# Altium schematic sheet Module_CYW20737A1KML2G.SchDoc
size A3; SheetNumber: 1; SheetTotal: 1
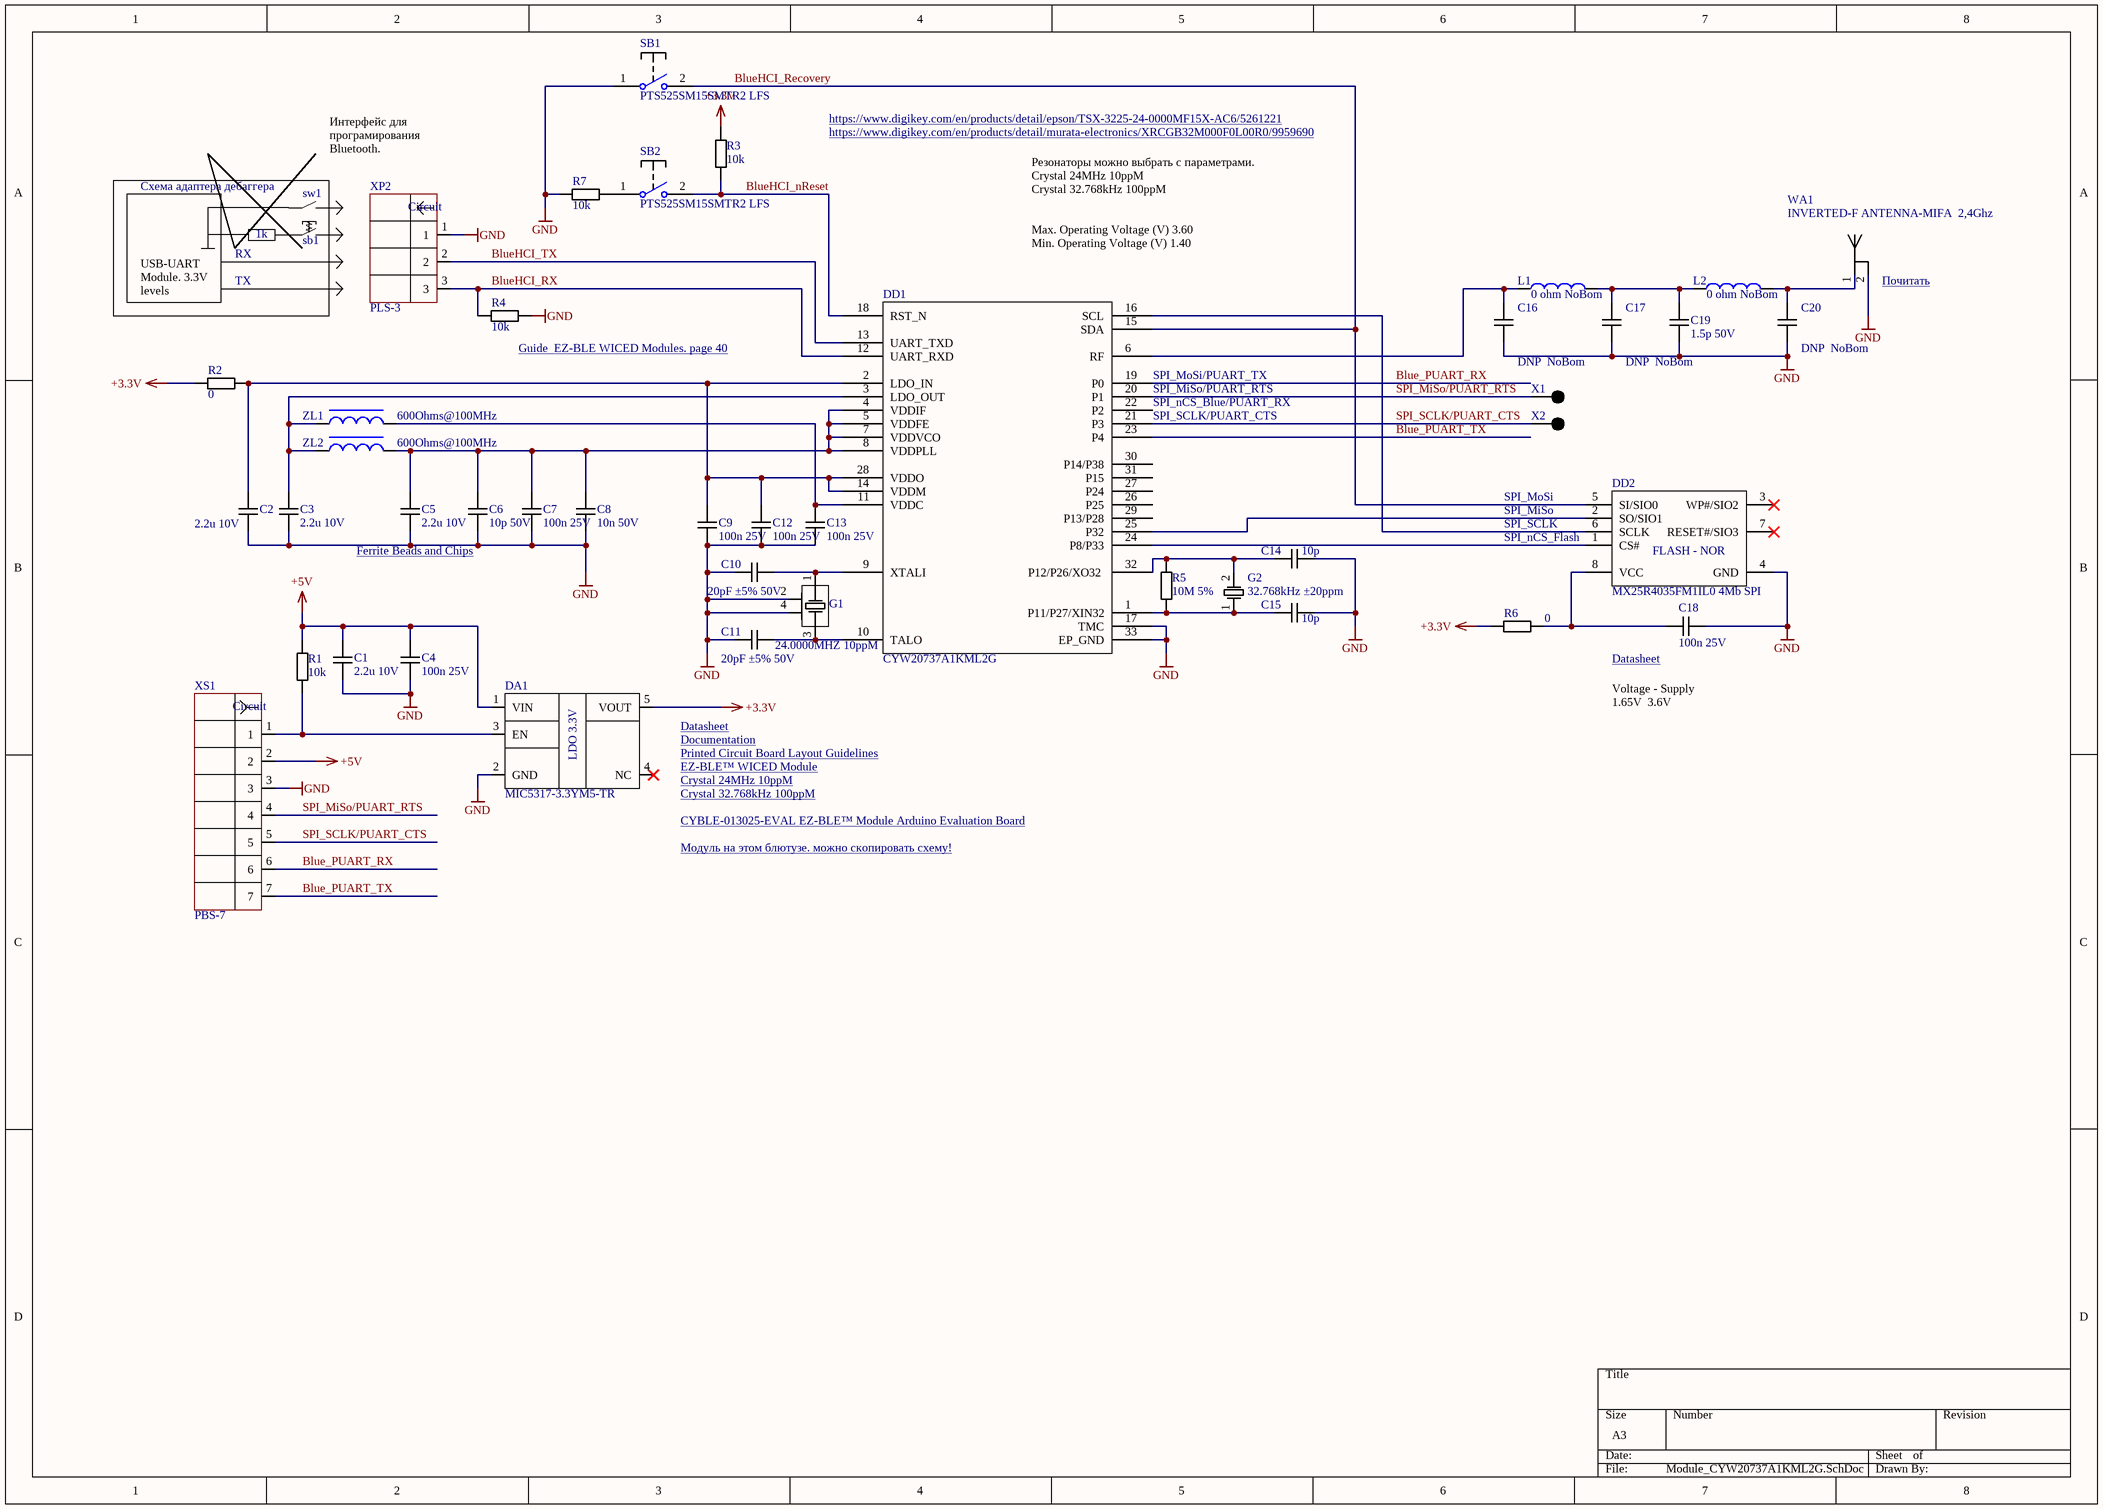
[diagram p0: Module_CYW20737A1KML2G.SchDoc]

## Parts
C1  2.2u 10V  [CapKemet1005(0402)]
C2  2.2u 10V  [CapKemet1005(0402)]
C3  2.2u 10V  [CapKemet1005(0402)]
C4  100n 25V  [CapKemet1005(0402)]
C5  2.2u 10V  [CapKemet1005(0402)]
C6  10p 50V  [CapKemet1005(0402)]
C7  100n 25V  [CapKemet1005(0402)]
C8  10n 50V  [CapKemet1005(0402)]
C9  100n 25V  [CapKemet1005(0402)]
C10  20pF ±5% 50V  [CapKemet1005(0402)]
C11  20pF ±5% 50V  [CapKemet1005(0402)]
C12  100n 25V  [CapKemet1005(0402)]
C13  100n 25V  [CapKemet1005(0402)]
C14  10p  [CapKemet1005(0402)]
C15  10p  [CapKemet1005(0402)]
C16  DNP  NoBom  [CapKemet1005(0402)]  (no BOM)
C17  DNP  NoBom  [CapKemet1005(0402)]  (no BOM)
C18  100n 25V  [CapKemet1005(0402)]
C19  1.5p 50V  [CapKemet1005(0402)]
C20  DNP  NoBom  [CapKemet1005(0402)]  (no BOM)
DA1  MIC5317-3.3YM5-TR  [SOT-23-OT5_N]
DD1  CYW20737A1KML2G  [QFN5X5-32_N]
DD2  MX25R4035FM1IL0 4Mb SPI  [MCHP-SOIC-SN8_M]
G1  24.0000MHZ 10ppM  [TSX-3225]
G2  32.768kHz ±20ppm  [VMK3-9005]
L1  0 ohm NoBom  [INDC1608(0603)N]  (no BOM)
L2  0 ohm NoBom  [INDC1608(0603)N]  (no BOM)
R1  10k  [REZKemet 0402]
R2  0  [REZKemet 0402]
R3  10k  [REZKemet 0402]
R4  10k  [REZKemet 0402]
R5  10M 5%  [REZKemet 0402]
R6  0  [REZKemet 0402]
R7  10k  [REZKemet 0402]
SB1  PTS525SM15SMTR2 LFS  [TACT_SWITCH KPT1187B]
SB2  PTS525SM15SMTR2 LFS  [TACT_SWITCH KPT1187B]
WA1  INVERTED-F ANTENNA-MIFA  2,4Ghz  [INVERTED-F ANTENNA-MIFA]  (net tie, no BOM)
X1  PLLS1.27-1-TOP-R  [PLLS1.27-1-TOP-R]  (value not drawn)
X2  PLLS1.27-1-TOP-R  [PLLS1.27-1-TOP-R]  (value not drawn)
XP2  PLS-3  [PLS-3-3D]
XS1  PBS-7  [PBS-7-3D]
ZL1  600Ohms@100MHz  [Ferrite1005(0402)]
ZL2  600Ohms@100MHz  [Ferrite1005(0402)]

## Nets
+3.3V: DA1.5(VOUT) R2.2 R3.2 R6.1
+5V: C1.2 C4.2 DA1.1(VIN) R1.2 XS1.2
GND: C1.1 C2.1 C3.1 C4.1 C5.1 C6.1 C7.1 C8.1 C9.1 C10.1 C11.1 C12.1 C13.1 C14.1 C15.1 C16.1 C17.1 C18.1 C19.1 C20.1 DA1.2(GND) DD1.17(TMC) DD1.33(EP_GND) DD2.4(GND) G1.2 G1.4 R4.1 R7.2 SB1.1(COMMON) WA1.2 XP2.1 XS1.3
Blue_PUART_RX: DD1.19(P0) XS1.6
Blue_PUART_TX: DD1.23(P4) XS1.7
BlueHCI_nReset: DD1.18(RST_N) R3.1 SB2.2(NO)
BlueHCI_Recovery: DD1.15(SDA) DD2.5(SI/SIO0) SB1.2(NO)
BlueHCI_RX: DD1.12(UART_RXD) R4.2 XP2.3
BlueHCI_TX: DD1.13(UART_TXD) XP2.2
SPI_MiSo/PUART_RTS: DD1.20(P1) X1.1 XS1.4
SPI_SCLK/PUART_CTS: DD1.21(P3) X2.1 XS1.5
NetC2_2: C2.2 C9.2 C12.2 DD1.2(LDO_IN) DD1.14(VDDM) DD1.28(VDDO) R2.1
NetC3_2: C3.2 DD1.3(LDO_OUT) ZL1.1 ZL2.1
NetC5_2: C5.2 C6.2 C7.2 C8.2 DD1.4(VDDIF) DD1.5(VDDFE) DD1.7(VDDVCO) DD1.8(VDDPLL) ZL2.2
NetC10_2: C10.2 DD1.9(XTALI) G1.1
NetC11_2: C11.2 DD1.10(TALO) G1.3
NetC13_2: C13.2 DD1.11(VDDC) ZL1.2
NetC14_2: C14.2 DD1.32(P12/P26/XO32) G2.2 R5.2
NetC15_2: C15.2 DD1.1(P11/P27/XIN32) G2.1 R5.1
NetC16_2: C16.2 DD1.6(RF) L1.1
NetC17_2: C17.2 C19.2 L1.2 L2.1
NetC18_2: C18.2 DD2.8(VCC) R6.2
NetC20_2: C20.2 L2.2 WA1.1
NetDA1_3: DA1.3(EN) R1.1 XS1.1
NetDD1_16: DD1.16(SCL) DD2.6(SCLK)
NetDD1_24: DD1.24(P8/P33) DD2.1(CS#)
NetDD1_25: DD1.25(P32) DD2.2(SO/SIO1)
NetR7_1: R7.1 SB2.1(COMMON)

Not connected (* = marked no-connect by the designer): DA1 4(NC)*; DD1 22(P2) 26(P25) 27(P24) 29(P13/P28) 30(P14/P38) 31(P15); DD2 3(WP#/SIO2)* 7(RESET#/SIO3)*

## Notes on the sheet
- Интерфейс для програмирования Bluetooth.
- https://www.digikey.com/en/products/detail/epson/TSX-3225-24-0000MF15X-AC6/5261221
- https://www.digikey.com/en/products/detail/murata-electronics/XRCGB32M000F0L00R0/9959690
- Схема адаптера дебаггера
- 1k
- sb1
- sw1
- Резонаторы можно выбрать с параметрами.
  Crystal 24MHz 10ppM
  Crystal 32.768kHz 100ppM
- USB-UART Module. 3.3V levels
- RX
- TX
- Max. Operating Voltage (V) 3.60
  Min. Operating Voltage (V) 1.40
- (near WA1) Почитать <https://devzone.nordicsemi.com/f/nordic-q-a/64229/ble-beacon-2-4ghz-pcb-antenna-layout-for-soc-nordic-nrf52832>
- (near R4) Guide  EZ-BLE WICED Modules. page 40 <https://www.cypress.com/file/396961/download>
- (near DD1) SPI_MoSi/PUART_TX
- (near DD1) SPI_MiSo/PUART_RTS
- (near DD1) SPI_nCS_Blue/PUART_RX
- (near DD1) SPI_SCLK/PUART_CTS
- SPI_MoSi
- SPI_MiSo
- Ferrite Beads and Chips <https://www.digikey.com/en/products/filter/ferrite-beads-and-chips/841?s=N4IgjCBcpgbFoDGUBmBDANgZwKYBoQB7KAbRAGYBOMAVgA4QBdAgBwBcoQBlNgJwEsAdgHMQAXwJhKdSghDJI6bPiKkQABiasOkbnyGiJIAEzG6m6PNSZcBYpDKx16gAQB5ABYBbLC4ACLmDOALIAEgBeWiDsnADChACuLBg4ACYAqoL8bG4owThoWAm8OOIEALTGcgp8CSr2ZDRRMbriRvCW-Kmc5UEQ2pwgBACObACenP0g4yyluoXIYmJAA>
- SPI_SCLK
- (near DD2) SPI_nCS_Flash
- (near C18) Datasheet <https://www.macronix.com/Lists/Datasheet/Attachments/7425/MX25R4035F,%20Wide%20Range,%204Mb,%20v1.4.pdf>
- Voltage - Supply
  1.65V  3.6V
- (near DA1) Crystal 24MHz 10ppM <https://www.digikey.com/en/products/filter/crystals/171?s=N4IgjCBcpgbFoDGUBmBDANgZwKYBoQB7KAbRACZyAOAZlgHYQC4rZYAWJ8WV2ATi4se5LuQAM5AKywIBSrTqjqNGoznKaA9bXYjtNaUtqStFZbDFG6es7Vg0rHR-AC6BAA4AXKCADKngCcASwA7AHMQAF8CfgQQZEh0bHwiUhB2MT5NBzcQLx9-YPCoggBaEWh4qECAVxTiSDJJEFz8yBAo6JBmyvcoMA8%2ByDAxMS74SqCAEx9Skdk873auAEdPAE8fBY33HB80LGRIyKA>
- (near DA1) Datasheet <https://www.cypress.com/file/333436/download>
- (near DA1) Documentation <https://www.cypress.com/part/cyw20737a1kml2g>
- (near DA1) Printed Circuit Board Layout Guidelines <https://www.cypress.com/file/298151/download>
- (near DA1) EZ-BLE™ WICED Module <https://www.digikey.com.au/htmldatasheets/production/2902866/0/0/1/CYBLE-013025-00-CYBLE-013030-00.pdf>
- (near DA1) Crystal 32.768kHz 100ppM <https://www.digikey.com/en/products/filter/crystals/171?s=N4IgjCBcpgbFoDGUBmBDANgZwKYBoQB7KAbRACZyAOAZlgHYQC4rZYAWJ8WV2ATi4se5LuQAM5AKywIBSrTqjqNGoznKaA9bXYjtNaUtqStFZbDFG6es7Vg0rHR-AC6BAA4AXKCADKngCcASwA7AHMQAF8CfgQQZEh0bHwiUhB2MT5NBzcQLx9-YPCoggBaEWh4qECAVxTiSDJJEFz8yBAo6JBmyvcoMA8%2ByDAxMS74SqCAEx9Skdk873auAEdPAE8fBY33HB80LGRIyKA>
- CYBLE-013025-EVAL EZ-BLE™ Module Arduino Evaluation Board <https://www.cypress.com/documentation/development-kitsboards/cyble-013025-eval-ez-ble-module-arduino-evaluation-board>
- Модуль на этом блютузе. можно скопировать схему! <https://www.cypress.com/part/cyble-013025-00>
- (in symbol MIC5317-3.3YM5-TR) LDO 3.3V
- (in symbol MX25R4035FM1IL0) FLASH - NOR
- (in symbol PBS-7) Circuit
- (in symbol PLS-3) Circuit

## Library data of the parts
C1-C3 C5 = LMK105BJ225MV-F: CAP CER 2.2uF 10V X5R 0402; Part Number: LMK105BJ225MV-F; Digi-Key Part Number: 587-3153-1-ND; HelpURL: https://www.digikey.com/en/products/detail/taiyo-yuden/LMK105BJ225MV-F/2774764; Manufacturer Part Number: LMK105BJ225MV-F; Price$: 0.01452; Package: 0402
C4 C7 C9 C12 C13 C18 = CL05B104KA5NNNC: CAP CER 0.1UF 25V X7R 0402; Part Number: CL05B104KA5NNNC; Digi-Key Part Number: 1276-6720-1-ND; HelpURL: https://www.digikey.com/en/products/detail/samsung-electro-mechanics/CL05B104KA5NNNC/5961204; Manufacturer Part Number: CL05B104KA5NNNC; Price$: 0.00487; Package: 0402
C6 = CL05C100DB5NNNC: CAP CER 10PF 50V C0G/NP0 0402; Part Number: CL05C100DB5NNNC; HelpURL: https://www.digikey.com/en/products/detail/samsung-electro-mechanics/CL05C100DB5NNNC/3887283; Digi-Key Part Number: 1276-1625-1-ND; Price$: 0.00647; Manufacturer Part Number: CL05C100DB5NNNC; Package: 0402
C8 = CL05B103KB5NNNC: CAP CER 10000PF 50V X7R 0402; Part Number: CL05B103KB5NNNC; HelpURL: https://www.digikey.com/en/products/detail/samsung-electro-mechanics/CL05B103KB5NNNC/3886686; Digi-Key Part Number: 1276-1028-1-ND; Price$: 0.00399; Manufacturer Part Number: CL05B103KB5NNNC; Package: 0402
C10 C11 = CC0402JRNPO9BN200: 20pF ±5% 50V Ceramic Capacitor C0G, NP0 0402 (1005 Metric); Part Number: CC0402JRNPO9BN200; HelpURL: https://www.digikey.com/en/products/detail/yageo/CC0402JRNPO9BN200/2833582; Digi-Key Part Number: 311-1417-1-ND; Price$: 0,1; Manufacturer Part Number: CC0402JRNPO9BN200
C14 C15 = CC0402DRNPO9BN100: 10pF 0402 50V C0G  +/-0.5pF; Part Number: CC0402DRNPO9BN100; HelpURL: https://www.digikey.com/en/products/detail/yageo/CC0402DRNPO9BN100/2297890?s=N4IgTCBcDaIMJwAwBZFgCICUByAFA8gJwBC2AjIoiALoC%2BQA; Price$: 0.1; Manufacturer Part Number: CC0402DRNPO9BN100; Package: 0402; Mouser Part Number: 603-CC402DRNPO9BN100
C16 C17 C20 = GCM1555C1H151JA16D: 150pF 0402 50V NP0  +/-5%; Part Number: GCM1555C1H151JA16D; HelpURL: https://eu.mouser.com/ProductDetail/Murata-Electronics/GCM1555C1H151JA16D?qs=%2Fha2pyFadugcbh64YeyVIuIl%252BPkOajCwN%252Ba25dmljYEPyTqNgKhHVA%3D%3D; Price$: 0.1; Manufacturer Part Number: GCM1555C1H151JA16D; Package: 0402; Mouser Part Number: 81-GCM1555C1H151J16D
C19 = CL05C1R5BB5NNNC: CAP CER 1.5pF 50V COG 0402 ±0.1pF; Part Number: CL05C1R5BB5NNNC; HelpURL: https://www.digikey.com/en/products/detail/samsung-electro-mechanics/CL05C1R5BB5NNNC/3887314; Digi-Key Part Number: 1276-1656-1-ND; Price$: 0.00874; Manufacturer Part Number: CL05C1R5BB5NNNC; Package: 0402
DA1 = MIC5317-3.3YM5-TR: Linear Voltage Regulator IC 1 Output 150mA SOT-23-5; Part Number: MIC5317-3.3YM5-TR; HelpURL: https://www.digikey.com/product-detail/en/microchip-technology/MIC5317-3.3YM5-TR/MIC5317-3.3YM5-CT-ND/7671939; Price$: 0,16; Digi-Key Part Number: MIC5317-3.3YM5-CT-ND; Manufacturer Part Number: MIC5317-3.3YM5-TR
DD1 = CYW20737A1KML2G: IC RF TXRX+MCU BLUETOOTH 32VFQFN; Part Number: CYW20737A1KML2G; HelpURL: https://www.digikey.com/en/products/detail/cypress-semiconductor-corp/CYW20737A1KML2G/6592884; Price$: 0,86; Digi-Key Part Number: 2015-CYW20737A1KML2G-ND; Manufacturer Part Number: CYW20737A1KML2G
DD2 = MX25R4035FM1IL0: IC FLASH 4M SPI 33MHZ 8SOP; Note: SOP 8L(150mil); Part Number: MX25R4035FM1IL0; HelpURL: https://www.digikey.com/en/products/detail/macronix/MX25R4035FM1IL0/6558612; Digi-Key Part Number: MX25R4035FM1IL0; Manufacturer Part Number: MX25R4035FM1IL0; Package: 8-SOP
G1 = TSX-3225 24.0000MF15X-AC6: 24MHz ±10ppm Crystal 9pF 40 Ohms 4-SMD, No Lead; Part Number: TSX-3225 24.0000MF15X-AC6; HelpURL: https://www.digikey.com/en/products/detail/epson/TSX-3225-24-0000MF15X-AC6/5261221; Price$: 0.33; Digi-Key Part Number: SER4180CT-ND; Manufacturer Part Number: TSX-3225 24.0000MF15X-AC6
G2 = VMK3-9005-32K7680000: 32.768kHz ±20ppm Crystal   2-SMD, No Lead; Part Number: VMK3-9005-32K7680000; HelpURL: https://www.digikey.com/en/products/detail/microchip-technology/VMK3-9005-32K7680000/13175117; Price$: 0.34; Digi-Key Part Number: 150-VMK3-9005-32K7680000CT-ND; Manufacturer Part Number: VMK3-9005-32K7680000
L1 L2 = AISC-0603-R27G-T: Fixed Inductors 270nH 2% -40C +125C; Part Number: AISC-0603-R27G-T; HelpURL: https://eu.mouser.com/ProductDetail/ABRACON/AISC-0603-R27G-T?qs=%2Fha2pyFaduhMG%2FX31G0KOK4wVUuURxruJbjcpPhZfbyFA8e1ZTy%2F3Q%3D%3D; Manufacturer Part Number: AISC-0603-R27G-T; Mouser Part Number: 815-AISC0603R27GT
R1 R3 R4 R7 = RESC1005(0402): RES SMD 5.1K OHM 1% 1/10W 0402; Manufacturer Part Number: ERJ-2RKF5101X; Part Number: RESC1005(0402); HelpURL: https://eu.mouser.com/ProductDetail/ROHM-Semiconductor/SFR01MZPF5101?qs=sGAEpiMZZMvdGkrng054t7z4BkURc4Lz8VVRSaz2ejIiXEQeYNXBXw%3D%3D; Price$: 0.1; Package: 0402; Mouser Part Number: 755-SFR01MZPF5101
R2 R6 = RMCF0402ZT0R00: RES SMD 0402 0 Ohm; Part Number: RMCF0402ZT0R00; HelpURL: https://www.digikey.com/en/products/detail/stackpole-electronics-inc/RMCF0402ZT0R00/1756905; Manufacturer Part Number: RMCF0402ZT0R00; Price$: 0.00186; Package: 0402; Mouser Part Number: RMCF0402ZT0R00CT-ND
R5 = RMCF0402JT10M0: RES SMD 0402 10 MOhm 5% 200ppm; Part Number: RMCF0402JT10M0; HelpURL: https://www.digikey.com/en/products/detail/stackpole-electronics-inc/RMCF0402JT10M0/1758210; Digi-Key Part Number: RMCF0402JT10M0CT-ND; Price$: 0.00186; Manufacturer Part Number: RMCF0402JT10M0; Package: 0402
SB1 SB2 = PTS525SM15SMTR2 LFS: SWITCH TACTILE SPST-NO 0.02A 15V; Part Number: PTS525SM15SMTR2 LFS; HelpURL: https://www.digikey.com/products/en?keywords=CKN9104CT-ND; Digi-Key Part Number: CKN9104CT-ND; Price$: 0.33; Manufacturer Part Number: PTS525SM15SMTR2 LFS
XP2 = PLS-3: CONN HEADER VERT 3POS 2.54MM; Manufacturer Part Number: PR20203VBNN; Part Number: PLS-3; HelpURL: https://www.digikey.com/product-detail/en/metz-connect-usa-inc/PR20203VBNN/1849-1003-ND/7794768; Digi-Key Part Number: 1849-1003-ND; Package: Header 3POS 2.54mm
ZL1 ZL2 = MMZ1005S601CT000: FERRITE BEAD 600 OHM 0402 1LN; Part Number: MMZ1005S601CT000; HelpURL: https://www.digikey.com/en/products/detail/tdk-corporation/MMZ1005S601CT000/765046; Price$: 0.02280; Digi-Key Part Number: 445-2162-1-ND; Manufacturer Part Number: MMZ1005S601CT000; Package: 0402
WA1 = INVERTED-F ANTENNA-MIFA  2,4Ghz: Part Number: INVERTED-F ANTENNA-MIFA  2,4Ghz; HelpURL: https://www.cypress.com/file/136236/download
X1 X2 = PLLS1.27-1-TOP-R: Part Number: PLLS1.27-1-TOP-R
XS1 = PBS-7: Part Number: PBS-7